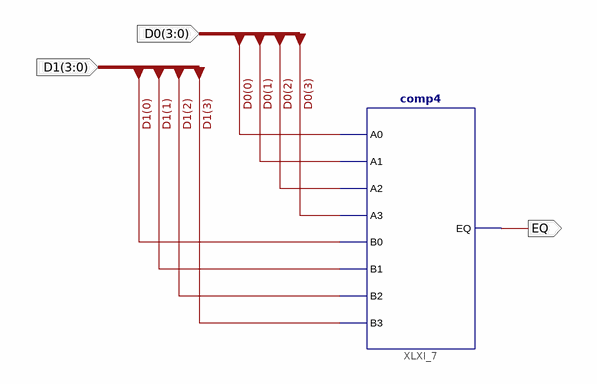
[diagram p0: schematic sheet 1]
// Xilinx ISE schematic comp2x4.sch (spartan6) as structural Verilog: 1 symbols, 3 ports
module comp2x4 (
  input  [3:0] D0,
  input  [3:0] D1,
  output EQ
);

  comp4 XLXI_7 (
    .A0(D0[0]), .A1(D0[1]), .A2(D0[2]), .A3(D0[3]), .B0(D1[0]), .B1(D1[1]), .B2(D1[2]), .B3(D1[3]), .EQ(EQ));
endmodule
